# Altium project WRO-TOF.PrjPcb
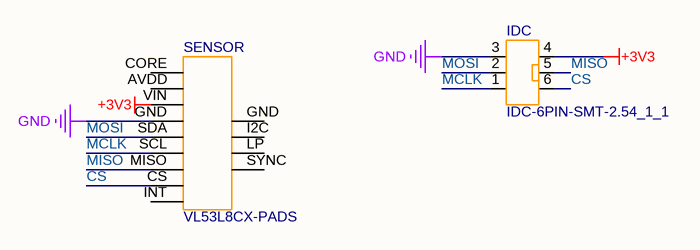
[diagram p0: TOF-SCH.SchDoc]
1 sheet, 2 parts. Net scope: global (net labels, ports and power ports of the same name join across sheets).
Board file: TOF-PCBPcbDoc.PcbDoc

## Sheet TOF-SCH.SchDoc
size A; SheetNumber: 1; SheetTotal: 1

### Parts
IDC  IDC-6PIN-SMT-2.54_1_1  [IDC-6PIN-SMT-2.54]
SENSOR  VL53L8CX-PADS  [VL53L8CX-PADS]

### Nets
+3V3: IDC.4 SENSOR.VIN
GND: IDC.3 SENSOR.GND
CS: IDC.6 SENSOR.CS
MCLK: IDC.1 SENSOR.SCL
MISO: IDC.5 SENSOR.MISO
MOSI: IDC.2 SENSOR.SDA

Not connected (* = marked no-connect by the designer): SENSOR AVDD(06) CORE(06) I2C(06) INT(01) LP(06) SYNC(06)